# EAGLE design untitled (EAGLE 9.6.2)

## Sheet 1 of 5
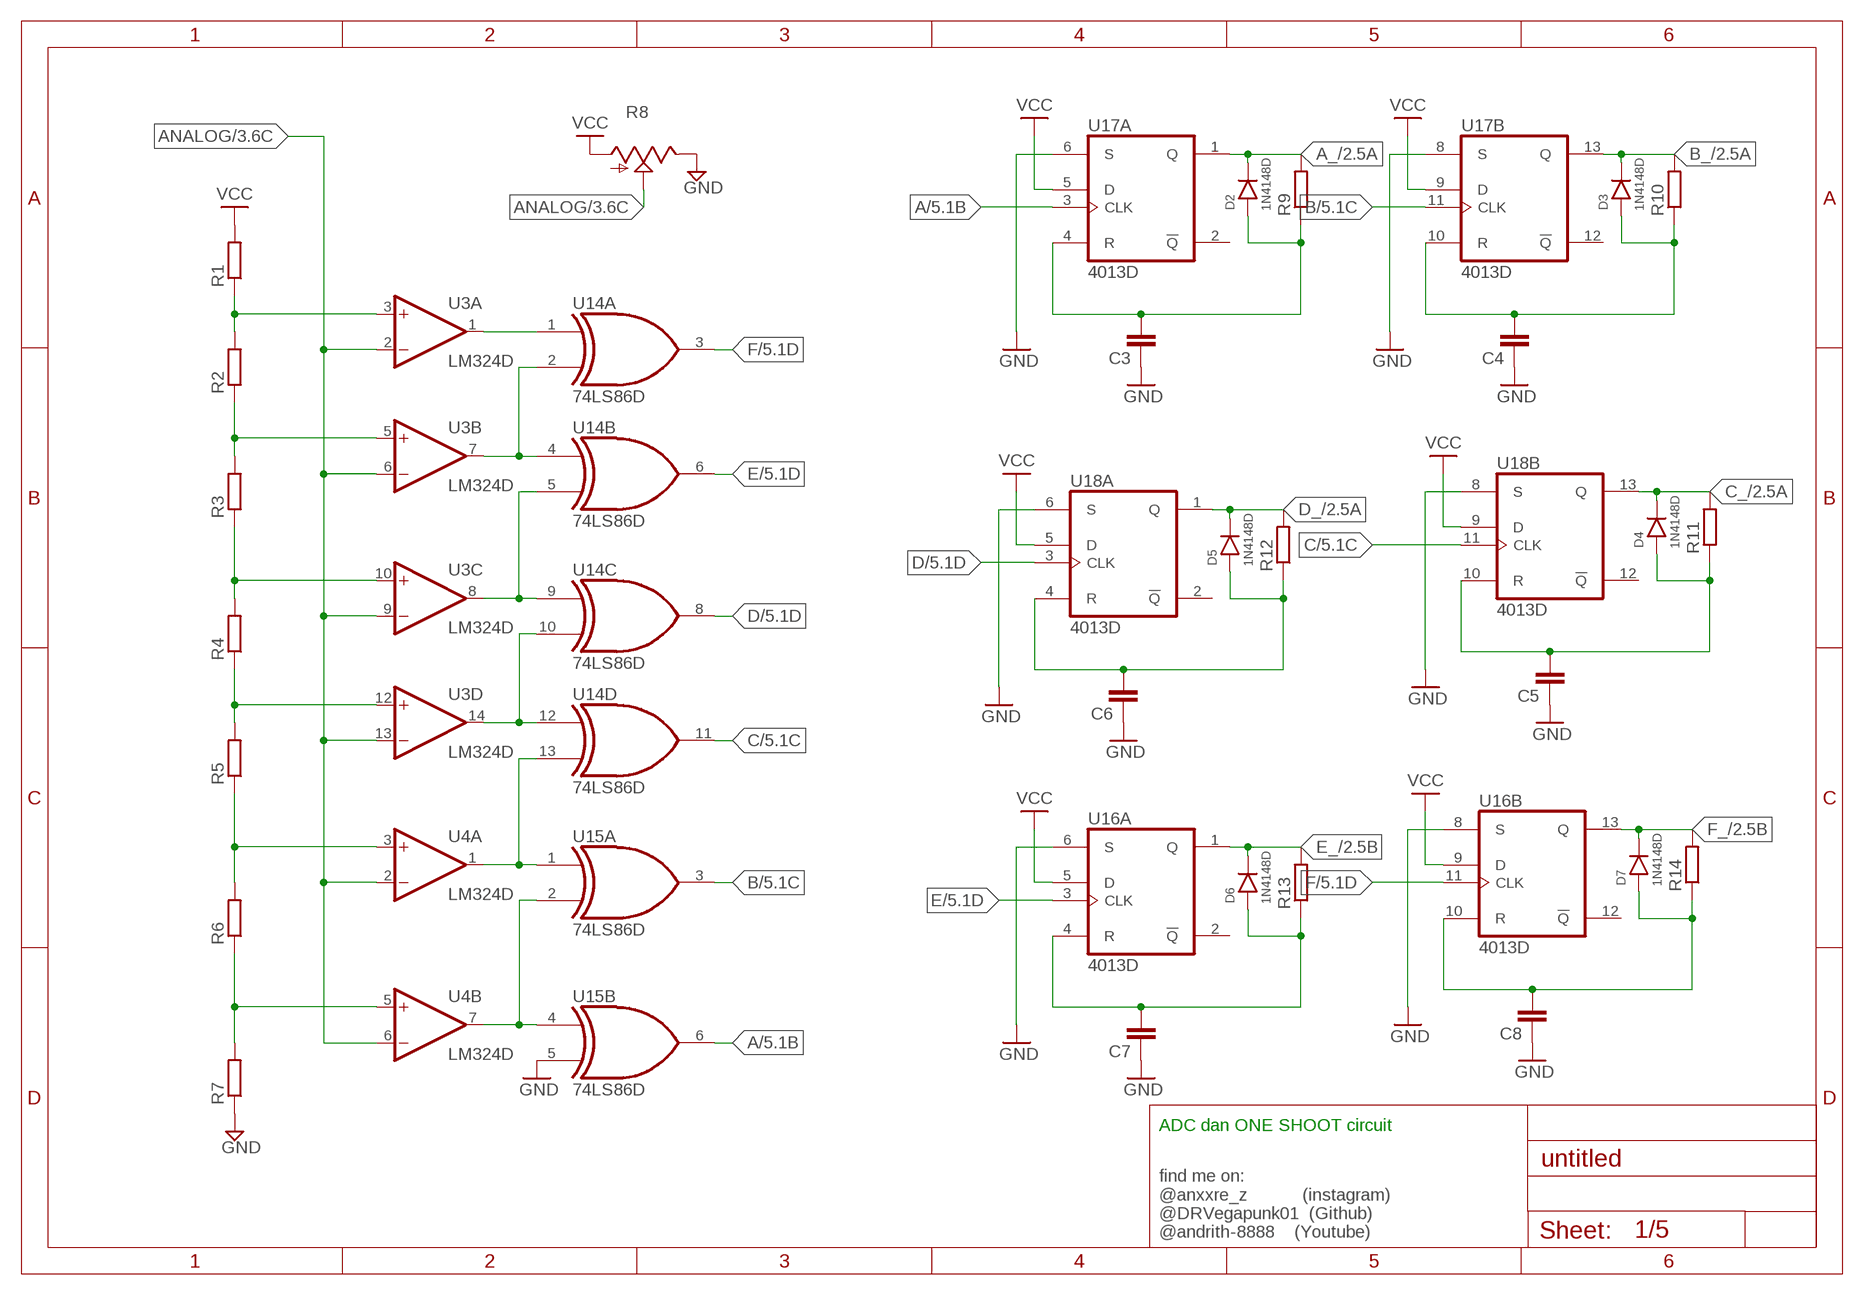
[diagram p0: schematic, sheet 1]

### Parts
C3  CAP-NON0805  [SMD0805]
C4  CAP-NON0805  [SMD0805]
C5  CAP-NON0805  [SMD0805]
C6  CAP-NON0805  [SMD0805]
C7  CAP-NON0805  [SMD0805]
C8  CAP-NON0805  [SMD0805]
D2  1N4148D  [SOD80C]
D3  1N4148D  [SOD80C]
D4  1N4148D  [SOD80C]
D5  1N4148D  [SOD80C]
D6  1N4148D  [SOD80C]
D7  1N4148D  [SOD80C]
R1  RES0805  [SMD0805]
R2  RES0805  [SMD0805]
R3  RES0805  [SMD0805]
R4  RES0805  [SMD0805]
R5  RES0805  [SMD0805]
R6  RES0805  [SMD0805]
R7  RES0805  [SMD0805]
R8  TRIM_US-CT6  [CT6]
R9  RES0805  [SMD0805]
R10  RES0805  [SMD0805]
R11  RES0805  [SMD0805]
R12  RES0805  [SMD0805]
R13  RES0805  [SMD0805]
R14  RES0805  [SMD0805]
U3  LM324D  [SO14]
U4  LM324D  [SO14]
U14  74LS86D  [SO14]
U15  74LS86D  [SO14]
U16  4013D  [SO14]
U17  4013D  [SO14]
U18  4013D  [SO14]

### Nets
A: U15.6(B:O) U17.3(A:CLK) ; also sheet 5
A_: D2.C R9.2 U17.1(A:Q) ; also sheet 2
ANALOG: R8.S U3.2(A:-IN) U3.6(B:-IN) U3.9(C:-IN) U3.13(D:-IN) U4.2(A:-IN) U4.6(B:-IN) ; also sheet 3
B: U15.3(A:O) U17.11(B:CLK) ; also sheet 5
B_: D3.C R10.2 U17.13(B:Q) ; also sheet 2
C: U14.11(D:O) U18.11(B:CLK) ; also sheet 5
C_: D4.C R11.2 U18.13(B:Q) ; also sheet 2
D: U14.8(C:O) U18.3(A:CLK) ; also sheet 5
D_: D5.C R12.2 U18.1(A:Q) ; also sheet 2
E: U14.6(B:O) U16.3(A:CLK) ; also sheet 5
E_: D6.C R13.2 U16.1(A:Q) ; also sheet 2
F: U14.3(A:O) U16.11(B:CLK) ; also sheet 5
F_: D7.C R14.2 U16.13(B:Q) ; also sheet 2
GND: C3.1 C4.1 C5.1 C6.1 C7.1 C8.1 R7.1 R8.E U15.5(B:I1) U16.6(A:S) U16.8(B:S) U17.6(A:S) U17.8(B:S) U18.6(A:S) U18.8(B:S) ; also sheet 3,4,5
N$3: R6.1 R7.2 U4.5(B:+IN)
N$4: R5.1 R6.2 U4.3(A:+IN)
N$5: R4.1 R5.2 U3.12(D:+IN)
N$6: R3.1 R4.2 U3.10(C:+IN)
N$7: R2.1 R3.2 U3.5(B:+IN)
N$8: R1.1 R2.2 U3.3(A:+IN)
N$9: U4.7(B:OUT) U15.2(A:I1) U15.4(B:I0)
N$10: U4.1(A:OUT) U14.13(D:I1) U15.1(A:I0)
N$11: U3.14(D:OUT) U14.10(C:I1) U14.12(D:I0)
N$12: C3.2 D2.A R9.1 U17.4(A:R)
N$13: U3.8(C:OUT) U14.5(B:I1) U14.9(C:I0)
N$14: U3.7(B:OUT) U14.2(A:I1) U14.4(B:I0)
N$15: U3.1(A:OUT) U14.1(A:I0)
N$16: C4.2 D3.A R10.1 U17.10(B:R)
N$19: C5.2 D4.A R11.1 U18.10(B:R)
N$21: C6.2 D5.A R12.1 U18.4(A:R)
N$23: C7.2 D6.A R13.1 U16.4(A:R)
N$25: C8.2 D7.A R14.1 U16.10(B:R)
VCC: R1.2 R8.A U16.5(A:D) U16.9(B:D) U17.5(A:D) U17.9(B:D) U18.5(A:D) U18.9(B:D) ; also sheet 3,4,5
Unconnected: U4.8(C:OUT) U4.9(C:-IN) U4.10(C:+IN) U4.12(D:+IN) U4.13(D:-IN) U4.14(D:OUT) U15.8(C:O) U15.9(C:I0) U15.10(C:I1) U15.11(D:O) U15.12(D:I0) U15.13(D:I1) U16.2(A:!Q) U16.12(B:!Q) U17.2(A:!Q) U17.12(B:!Q) U18.2(A:!Q) U18.12(B:!Q)

### Notes on the sheet
- ADC dan ONE SHOOT circuit
- find me on:
  @anxxre_z           (instagram)
  @DRVegapunk01  (Github)
  @andrith-8888    (Youtube)

## Sheet 2 of 5
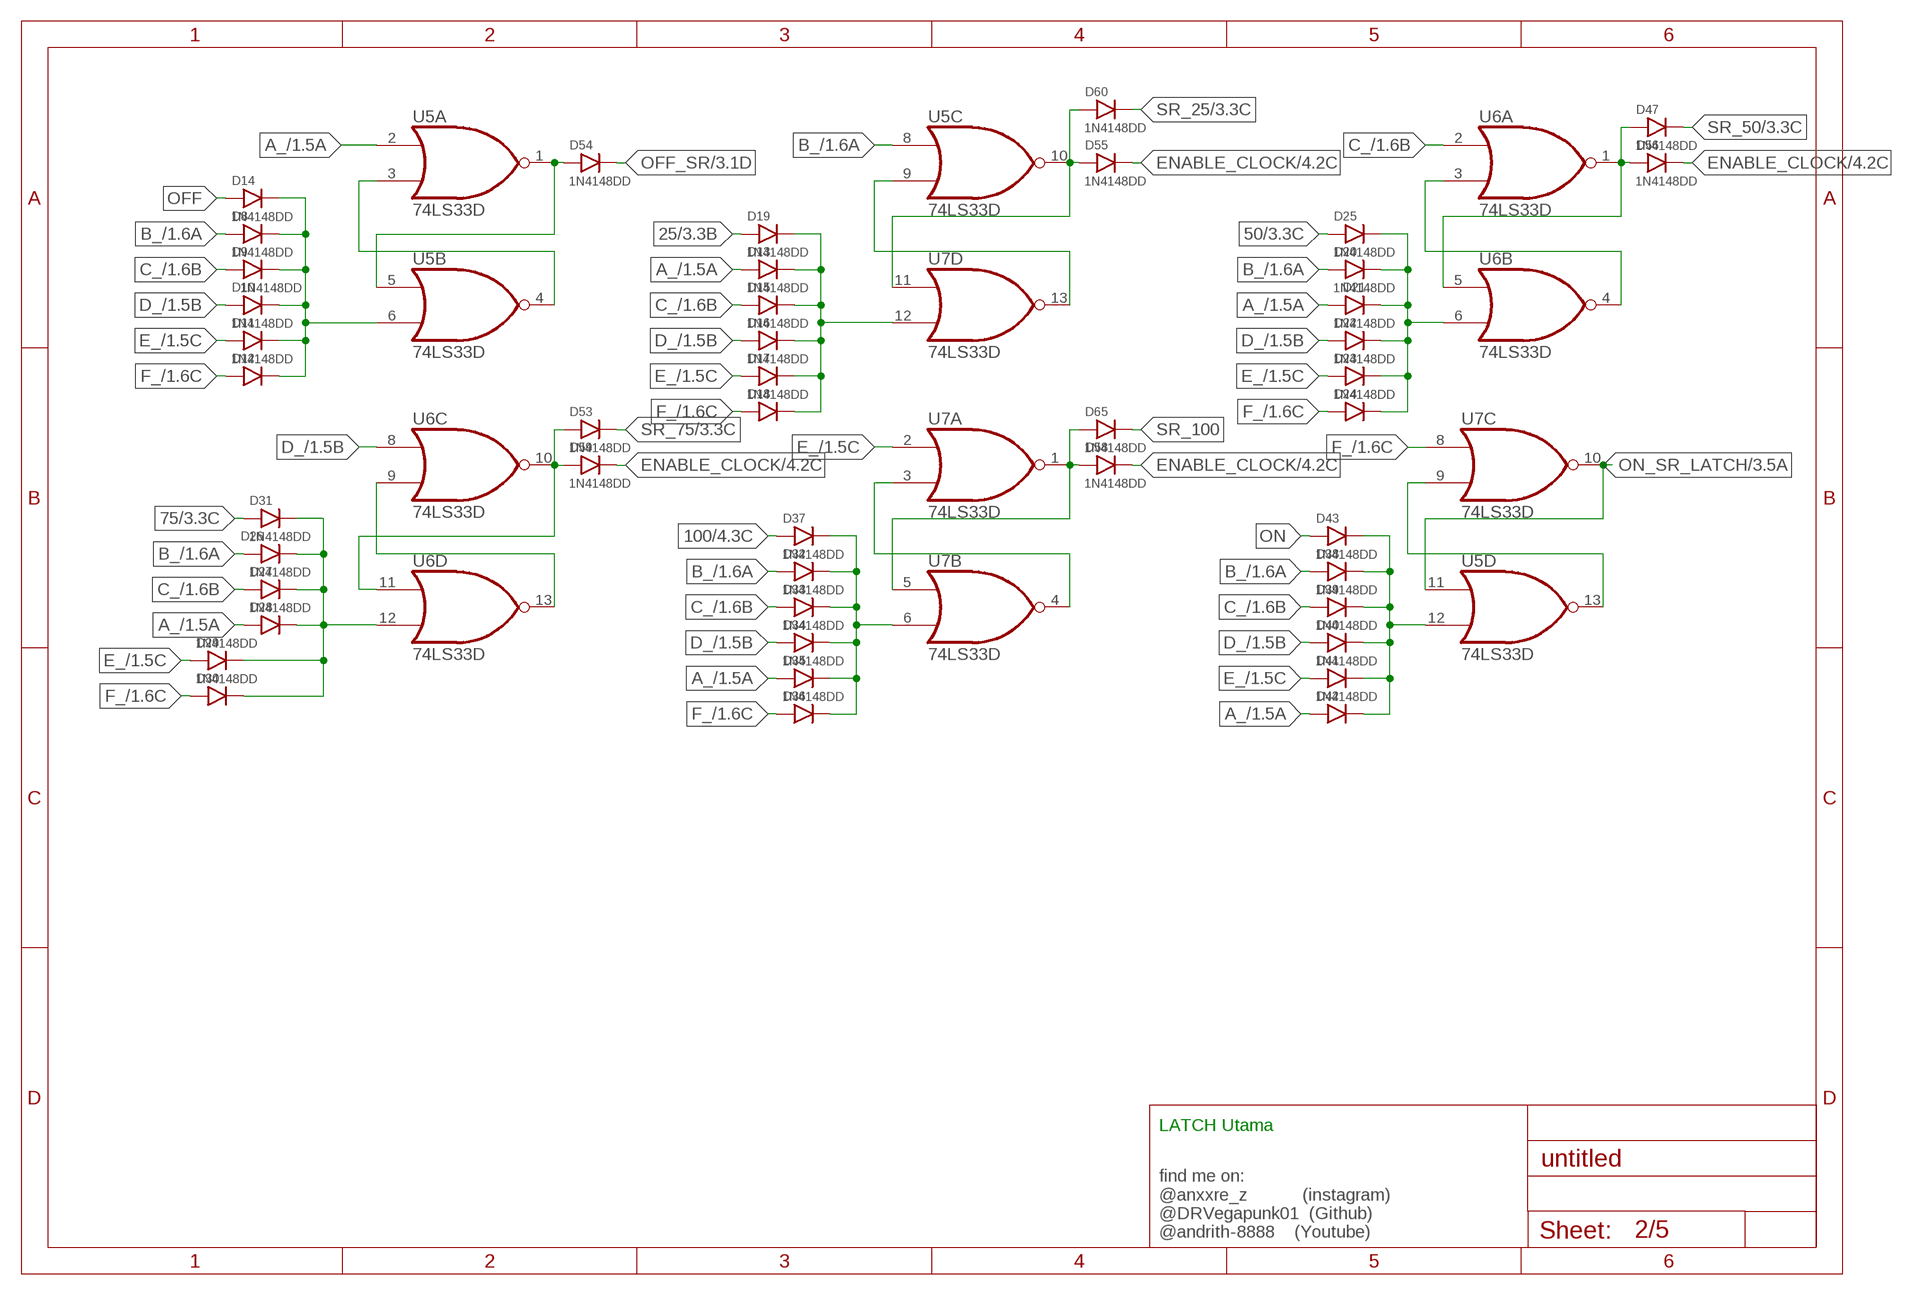
[diagram p1: schematic, sheet 2]

### Parts
D8  1N4148DD  [SOD123]
D9  1N4148DD  [SOD123]
D10  1N4148DD  [SOD123]
D11  1N4148DD  [SOD123]
D12  1N4148DD  [SOD123]
D13  1N4148DD  [SOD123]
D14  1N4148DD  [SOD123]
D15  1N4148DD  [SOD123]
D16  1N4148DD  [SOD123]
D17  1N4148DD  [SOD123]
D18  1N4148DD  [SOD123]
D19  1N4148DD  [SOD123]
D20  1N4148DD  [SOD123]
D21  1N4148DD  [SOD123]
D22  1N4148DD  [SOD123]
D23  1N4148DD  [SOD123]
D24  1N4148DD  [SOD123]
D25  1N4148DD  [SOD123]
D26  1N4148DD  [SOD123]
D27  1N4148DD  [SOD123]
D28  1N4148DD  [SOD123]
D29  1N4148DD  [SOD123]
D30  1N4148DD  [SOD123]
D31  1N4148DD  [SOD123]
D32  1N4148DD  [SOD123]
D33  1N4148DD  [SOD123]
D34  1N4148DD  [SOD123]
D35  1N4148DD  [SOD123]
D36  1N4148DD  [SOD123]
D37  1N4148DD  [SOD123]
D38  1N4148DD  [SOD123]
D39  1N4148DD  [SOD123]
D40  1N4148DD  [SOD123]
D41  1N4148DD  [SOD123]
D42  1N4148DD  [SOD123]
D43  1N4148DD  [SOD123]
D47  1N4148DD  [SOD123]
D53  1N4148DD  [SOD123]
D54  1N4148DD  [SOD123]
D55  1N4148DD  [SOD123]
D56  1N4148DD  [SOD123]
D58  1N4148DD  [SOD123]
D59  1N4148DD  [SOD123]
D60  1N4148DD  [SOD123]
D65  1N4148DD  [SOD123]
U5  74LS33D  [SO14]
U6  74LS33D  [SO14]
U7  74LS33D  [SO14]

### Nets
25: D19.A ; also sheet 3,4
50: D25.A ; also sheet 3,4
75: D31.A ; also sheet 3,4
100: D37.A ; also sheet 4
A_: D13.A D21.A D28.A D35.A D42.A U5.2(A:I0) ; also sheet 1
B_: D8.A D20.A D26.A D32.A D38.A U5.8(C:I0) ; also sheet 1
C_: D9.A D15.A D27.A D33.A D39.A U6.2(A:I0) ; also sheet 1
D_: D10.A D16.A D22.A D34.A D40.A U6.8(C:I0) ; also sheet 1
E_: D11.A D17.A D23.A D29.A D41.A U7.2(A:I0) ; also sheet 1
ENABLE_CLOCK: D55.C D56.C D58.C D59.C ; also sheet 4
F_: D12.A D18.A D24.A D30.A D36.A U7.8(C:I0) ; also sheet 1
N$20: U5.3(A:I1) U5.4(B:O)
N$22: D20.C D21.C D22.C D23.C D24.C D25.C U6.6(B:I1)
N$24: D8.C D9.C D10.C D11.C D12.C D14.C U5.6(B:I1)
N$26: D26.C D27.C D28.C D29.C D30.C D31.C U6.12(D:I1)
N$27: U6.9(C:I1) U6.13(D:O)
N$28: D32.C D33.C D34.C D35.C D36.C D37.C U7.6(B:I1)
N$29: D38.C D39.C D40.C D41.C D42.C D43.C U5.12(D:I1)
N$30: U7.3(A:I1) U7.4(B:O)
N$32: U5.9(C:I1) U7.13(D:O)
N$34: U6.3(A:I1) U6.4(B:O)
N$36: U5.13(D:O) U7.9(C:I1)
N$41: D13.C D15.C D16.C D17.C D18.C D19.C U7.12(D:I1)
OFF: D14.A
OFF_SR: D54.C ; also sheet 3
ON: D43.A
ON_SR_LATCH: U5.11(D:I0) U7.10(C:O) ; also sheet 3
Q1: D54.A U5.1(A:O) U5.5(B:I0)
Q2: D55.A D60.A U5.10(C:O) U7.11(D:I0)
Q3: D47.A D56.A U6.1(A:O) U6.5(B:I0)
Q4: D53.A D59.A U6.10(C:O) U6.11(D:I0)
Q5: D58.A D65.A U7.1(A:O) U7.5(B:I0)
SR_25: D60.C ; also sheet 3
SR_50: D47.C ; also sheet 3
SR_75: D53.C ; also sheet 3
SR_100: D65.C

### Notes on the sheet
- LATCH Utama
- find me on:
  @anxxre_z           (instagram)
  @DRVegapunk01  (Github)
  @andrith-8888    (Youtube)

## Sheet 3 of 5
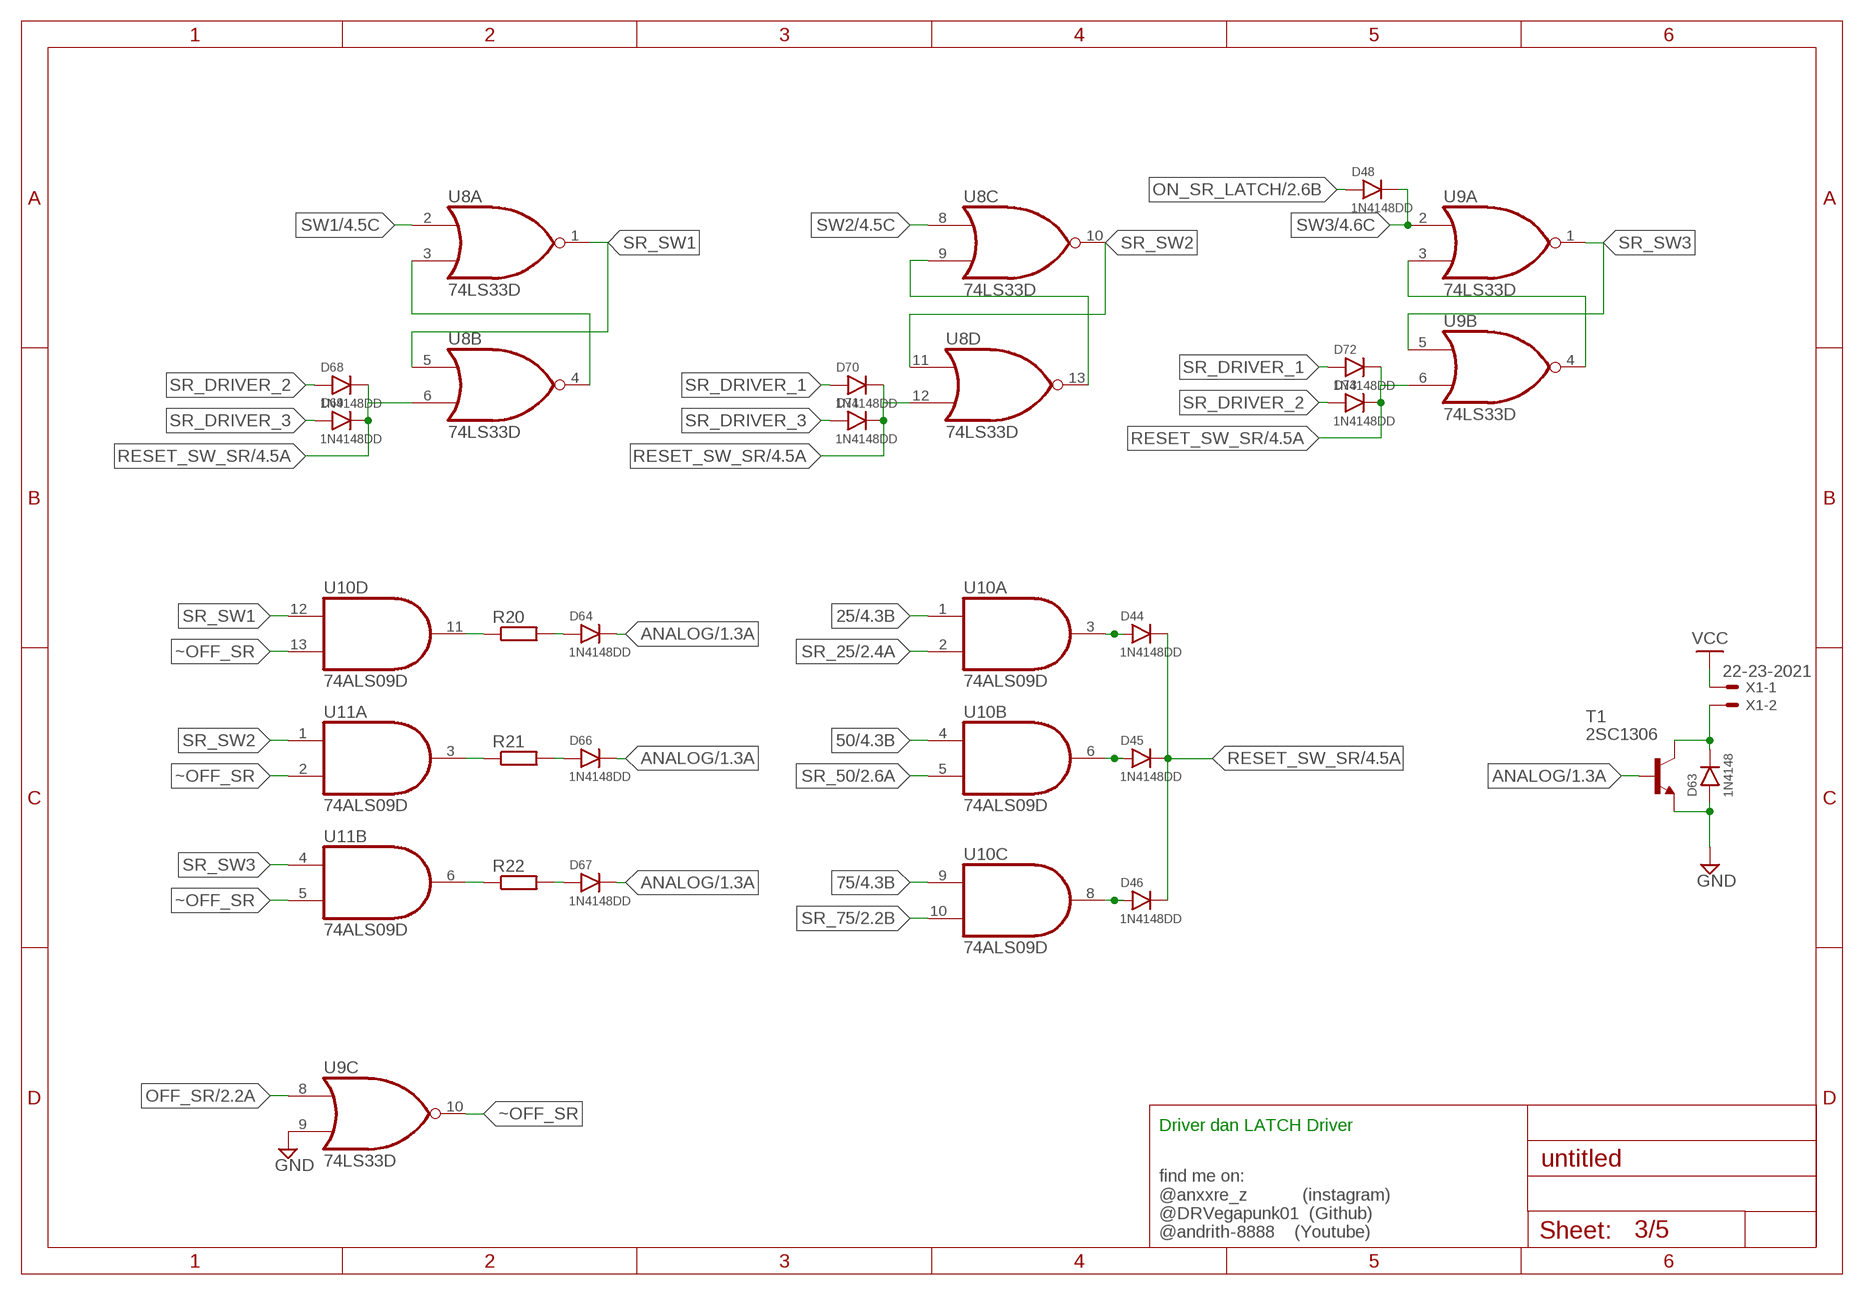
[diagram p2: schematic, sheet 3]

### Parts
D44  1N4148DD  [SOD123]
D45  1N4148DD  [SOD123]
D46  1N4148DD  [SOD123]
D48  1N4148DD  [SOD123]
D63  1N4148  [DIODE]
D64  1N4148DD  [SOD123]
D66  1N4148DD  [SOD123]
D67  1N4148DD  [SOD123]
D68  1N4148DD  [SOD123]
D69  1N4148DD  [SOD123]
D70  1N4148DD  [SOD123]
D71  1N4148DD  [SOD123]
D72  1N4148DD  [SOD123]
D73  1N4148DD  [SOD123]
R20  RES0805  [SMD0805]
R21  RES0805  [SMD0805]
R22  RES0805  [SMD0805]
T1  2SC1306  [TO220BV]
U8  74LS33D  [SO14]
U9  74LS33D  [SO14]
U10  74ALS09D  [SO14]
U11  74ALS09D  [SO14]
X1  22-23-2021  [22-23-2021]

### Nets
25: U10.1(A:I0) ; also sheet 2,4
50: U10.4(B:I0) ; also sheet 2,4
75: U10.9(C:I0) ; also sheet 2,4
ANALOG: D64.C D66.C D67.C T1.1(B) ; also sheet 1
GND: D63.1 T1.3(E) U9.9(C:I1) ; also sheet 1,4,5
N$39: R22.1 U11.6(B:O)
N$40: D67.A R22.2
N$43: U8.3(A:I1) U8.4(B:O)
N$45: D66.A R21.2
N$46: R21.1 U11.3(A:O)
N$47: D63.2 T1.2(C) X1.2
N$48: D64.A R20.2
N$49: R20.1 U10.11(D:O)
N$51: U8.9(C:I1) U8.13(D:O)
N$53: D44.A U10.3(A:O)
N$54: D45.A U10.6(B:O)
N$55: D46.A U10.8(C:O)
N$56: U9.3(A:I1) U9.4(B:O)
OFF_SR: U9.8(C:I0) ; also sheet 2
ON_SR_LATCH: D48.A ; also sheet 2
RESET_SW_SR: D44.C D45.C D46.C D68.C D69.C D70.C D71.C D72.C D73.C U8.6(B:I1) U8.12(D:I1) U9.6(B:I1) ; also sheet 4
SR_25: U10.2(A:I1) ; also sheet 2
SR_50: U10.5(B:I1) ; also sheet 2
SR_75: U10.10(C:I1) ; also sheet 2
SR_DRIVER_1: D70.A D72.A
SR_DRIVER_2: D68.A D73.A
SR_DRIVER_3: D69.A D71.A
SR_SW1: U8.1(A:O) U8.5(B:I0) U10.12(D:I0)
SR_SW2: U8.10(C:O) U8.11(D:I0) U11.1(A:I0)
SR_SW3: U9.1(A:O) U9.5(B:I0) U11.4(B:I0)
SW1: U8.2(A:I0) ; also sheet 4
SW2: U8.8(C:I0) ; also sheet 4
SW3: D48.C U9.2(A:I0) ; also sheet 4
VCC: X1.1 ; also sheet 1,4,5
~OFF_SR: U9.10(C:O) U10.13(D:I1) U11.2(A:I1) U11.5(B:I1)
Unconnected: U9.11(D:I0) U9.12(D:I1) U9.13(D:O) U11.8(C:O) U11.9(C:I0) U11.10(C:I1) U11.11(D:O) U11.12(D:I0) U11.13(D:I1)

### Notes on the sheet
- Driver dan LATCH Driver
- find me on:
  @anxxre_z           (instagram)
  @DRVegapunk01  (Github)
  @andrith-8888    (Youtube)

## Sheet 4 of 5
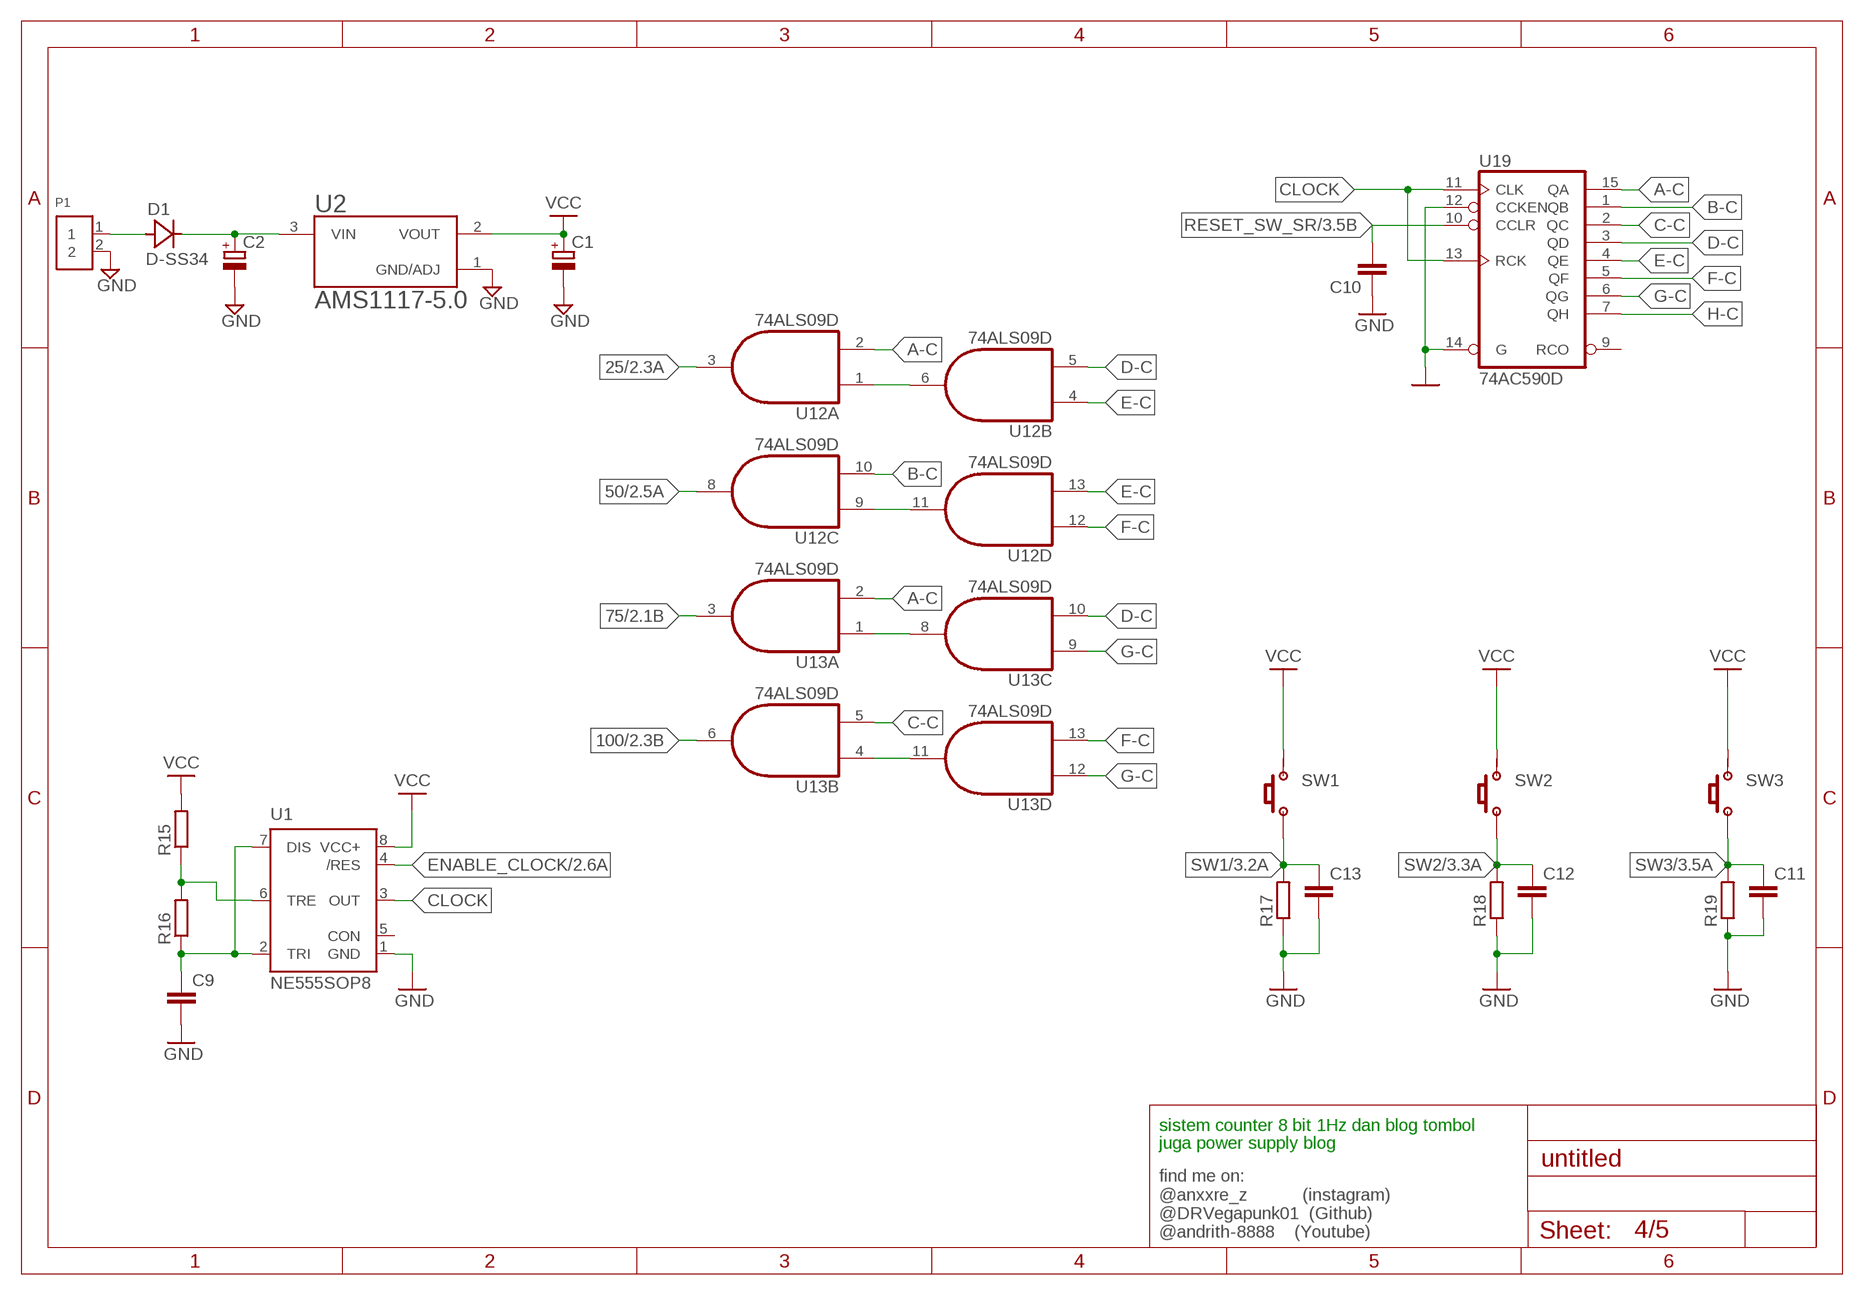
[diagram p3: schematic, sheet 4]

### Parts
C1  CAP-POLARE5-4  [E5-4]
C2  CAP-POLARE5-4  [E5-4]
C9  CAP-NON0805  [SMD0805]
C10  CAP-NON0805  [SMD0805]
C11  CAP-NON0805  [SMD0805]
C12  CAP-NON0805  [SMD0805]
C13  CAP-NON0805  [SMD0805]
D1  D-SS34  [SMA]
P1  TERMINALBLOK  [TB-2P]
R15  RES0805  [SMD0805]
R16  RES0805  [SMD0805]
R17  RES0805  [SMD0805]
R18  RES0805  [SMD0805]
R19  RES0805  [SMD0805]
SW1  PUSH_BUTTON4P  [PUSH_BUTTON_4P]
SW2  PUSH_BUTTON4P  [PUSH_BUTTON_4P]
SW3  PUSH_BUTTON4P  [PUSH_BUTTON_4P]
U1  NE555SOP8  [SO08]
U2  AMS1117-5.0  [SOT229P700X180-4N]
U12  74ALS09D  [SO14]
U13  74ALS09D  [SO14]
U19  74AC590D  [SO16]

### Nets
25: U12.3(A:O) ; also sheet 2,3
50: U12.8(C:O) ; also sheet 2,3
75: U13.3(A:O) ; also sheet 2,3
100: U13.6(B:O) ; also sheet 2
A-C: U12.2(A:I1) U13.2(A:I1) U19.15(QA)
B-C: U12.10(C:I1) U19.1(QB)
C-C: U13.5(B:I1) U19.2(QC)
CLOCK: U1.3(OUT) U19.11(CLK) U19.13(RCK)
D-C: U12.5(B:I1) U13.10(C:I1) U19.3(QD)
E-C: U12.4(B:I0) U12.13(D:I1) U19.4(QE)
ENABLE_CLOCK: U1.4(/RES) ; also sheet 2
F-C: U12.12(D:I0) U13.13(D:I1) U19.5(QF)
G-C: U13.9(C:I0) U13.12(D:I0) U19.6(QG)
GND: C1.- C2.- C9.2 C10.2 C11.2 C12.2 C13.2 P1.2 R17.1 R18.1 R19.1 U1.1(GND) U2.1(GND/ADJ) U19.12(CCKEN) U19.14(G) ; also sheet 1,3,5
H-C: U19.7(QH)
N$1: D1.A P1.1
N$2: C2.+ D1.C U2.3(VIN)
N$17: C9.1 R16.1 U1.2(TRI) U1.7(DIS)
N$18: R15.1 R16.2 U1.6(TRE)
N$31: U12.1(A:I0) U12.6(B:O)
N$33: U12.9(C:I0) U12.11(D:O)
N$35: U13.1(A:I0) U13.8(C:O)
N$37: U13.4(B:I0) U13.11(D:O)
RESET_SW_SR: C10.1 U19.10(CCLR) ; also sheet 3
SW1: C13.1 R17.2 SW1.1 SW1.2 ; also sheet 3
SW2: C12.1 R18.2 SW2.1 SW2.2 ; also sheet 3
SW3: C11.1 R19.2 SW3.1 SW3.2 ; also sheet 3
VCC: C1.+ R15.2 SW1.3 SW1.4 SW2.3 SW2.4 SW3.3 SW3.4 U1.8(VCC+) U2.2(VOUT) ; also sheet 1,3,5
Unconnected: U1.5(CON) U19.9(RCO)

### Notes on the sheet
- sistem counter 8 bit 1Hz dan blog tombol
- juga power supply blog
- find me on:
  @anxxre_z           (instagram)
  @DRVegapunk01  (Github)
  @andrith-8888    (Youtube)

## Sheet 5 of 5
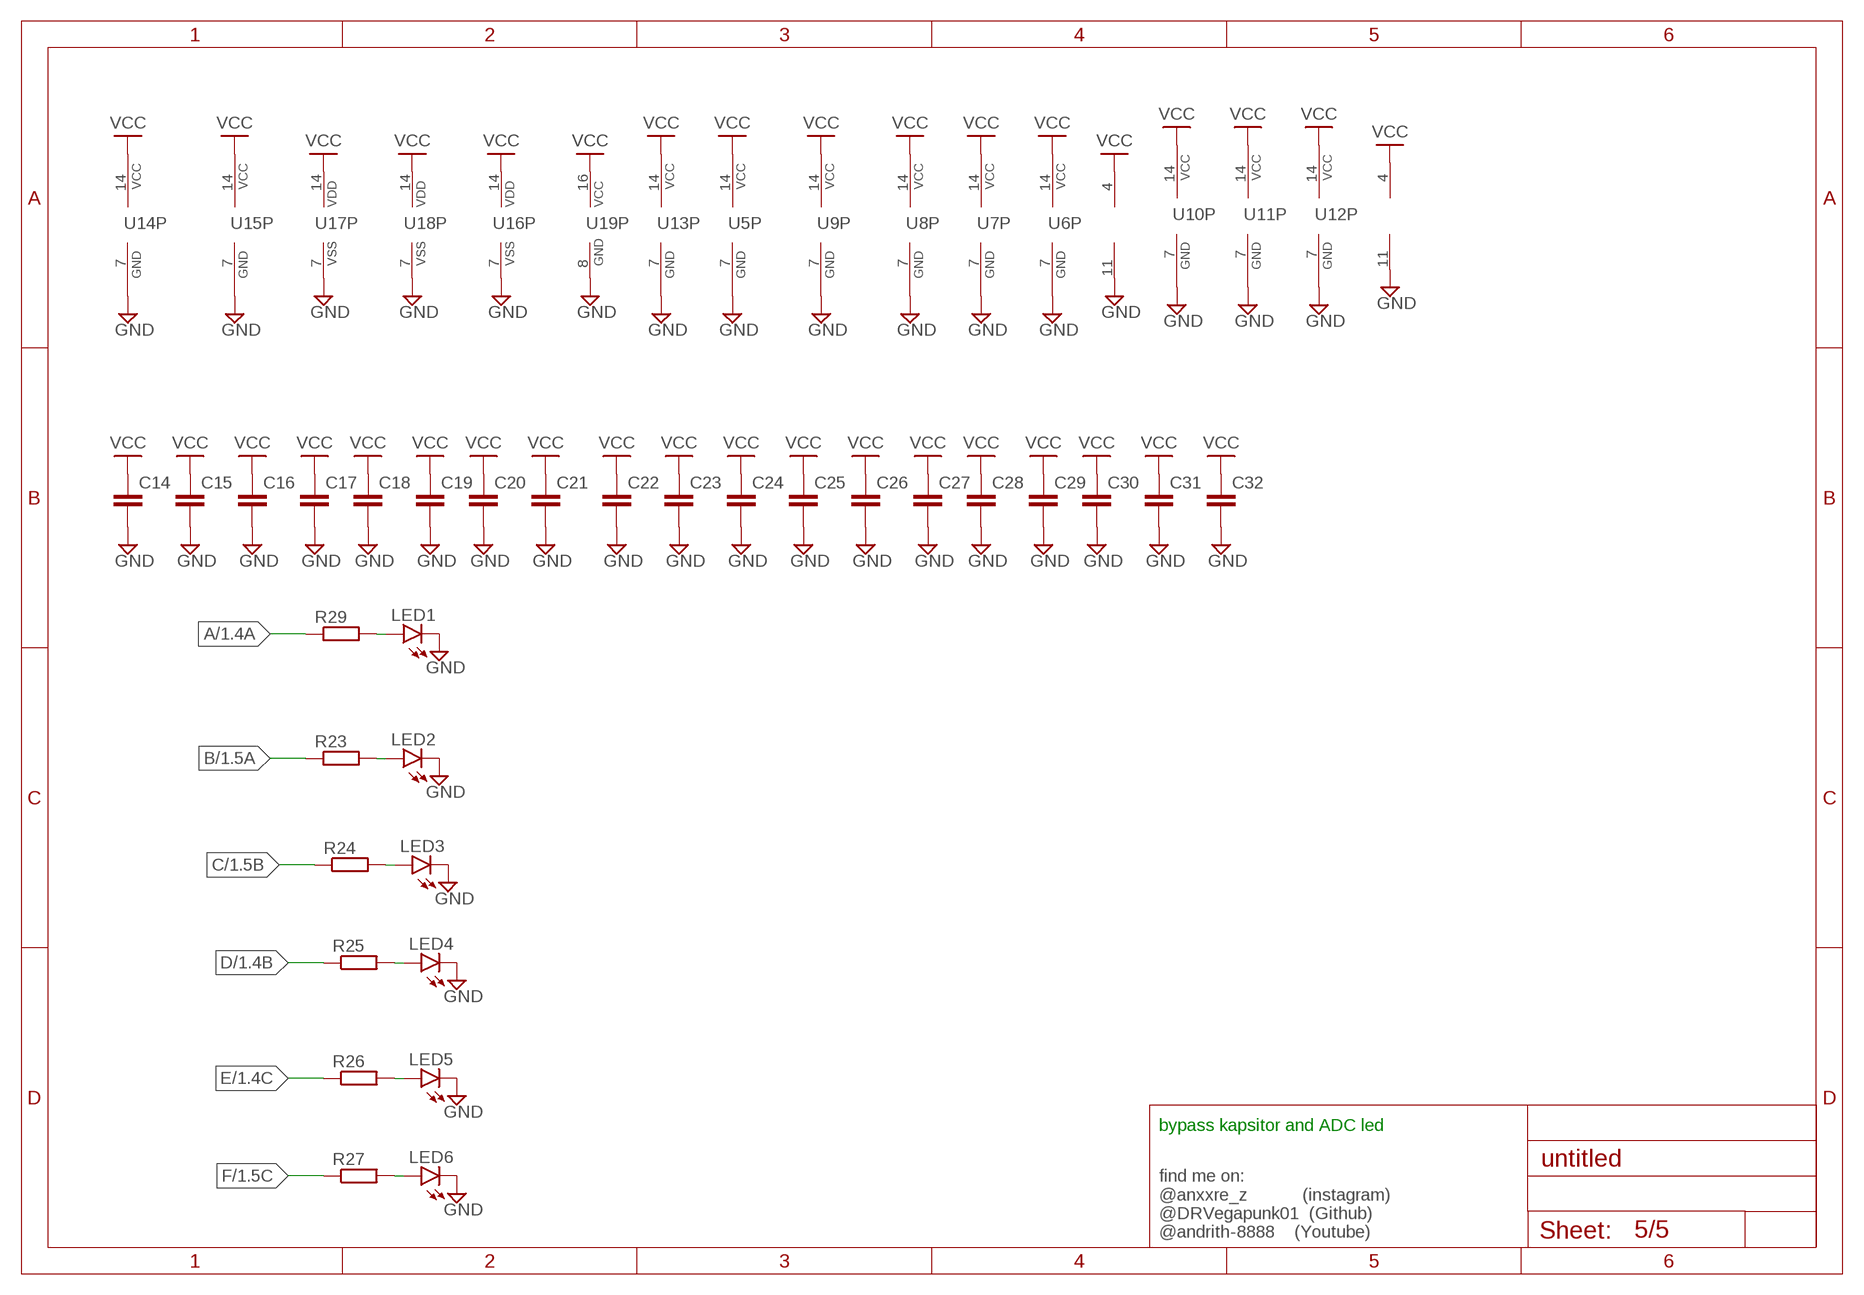
[diagram p4: schematic, sheet 5]

### Parts
C14  CAP-NON0805  [SMD0805]
C15  CAP-NON0805  [SMD0805]
C16  CAP-NON0805  [SMD0805]
C17  CAP-NON0805  [SMD0805]
C18  CAP-NON0805  [SMD0805]
C19  CAP-NON0805  [SMD0805]
C20  CAP-NON0805  [SMD0805]
C21  CAP-NON0805  [SMD0805]
C22  CAP-NON0805  [SMD0805]
C23  CAP-NON0805  [SMD0805]
C24  CAP-NON0805  [SMD0805]
C25  CAP-NON0805  [SMD0805]
C26  CAP-NON0805  [SMD0805]
C27  CAP-NON0805  [SMD0805]
C28  CAP-NON0805  [SMD0805]
C29  CAP-NON0805  [SMD0805]
C30  CAP-NON0805  [SMD0805]
C31  CAP-NON0805  [SMD0805]
C32  CAP-NON0805  [SMD0805]
LED1  LED0805  [CHIPLED_0805]
LED2  LED0805  [CHIPLED_0805]
LED3  LED0805  [CHIPLED_0805]
LED4  LED0805  [CHIPLED_0805]
LED5  LED0805  [CHIPLED_0805]
LED6  LED0805  [CHIPLED_0805]
R23  RES0805  [SMD0805]
R24  RES0805  [SMD0805]
R25  RES0805  [SMD0805]
R26  RES0805  [SMD0805]
R27  RES0805  [SMD0805]
R29  RES0805  [SMD0805]

### Nets
A: R29.1 ; also sheet 1
B: R23.1 ; also sheet 1
C: R24.1 ; also sheet 1
D: R25.1 ; also sheet 1
E: R26.1 ; also sheet 1
F: R27.1 ; also sheet 1
GND: C14.2 C15.2 C16.2 C17.2 C18.2 C19.2 C20.2 C21.2 C22.2 C23.2 C24.2 C25.2 C26.2 C27.2 C28.2 C29.2 C30.2 C31.2 C32.2 LED1.C LED2.C LED3.C LED4.C LED5.C LED6.C U3.11(P:V-) U4.11(P:V-) U5.7(P:GND) U6.7(P:GND) U7.7(P:GND) U8.7(P:GND) U9.7(P:GND) U10.7(P:GND) U11.7(P:GND) U12.7(P:GND) U13.7(P:GND) U14.7(P:GND) U15.7(P:GND) U16.7(P:VSS) U17.7(P:VSS) U18.7(P:VSS) U19.8(GND) ; also sheet 1,3,4
N$38: LED3.A R24.2
N$42: LED4.A R25.2
N$44: LED5.A R26.2
N$50: LED6.A R27.2
N$57: LED1.A R29.2
N$63: LED2.A R23.2
VCC: C14.1 C15.1 C16.1 C17.1 C18.1 C19.1 C20.1 C21.1 C22.1 C23.1 C24.1 C25.1 C26.1 C27.1 C28.1 C29.1 C30.1 C31.1 C32.1 U3.4(P:V+) U4.4(P:V+) U5.14(P:VCC) U6.14(P:VCC) U7.14(P:VCC) U8.14(P:VCC) U9.14(P:VCC) U10.14(P:VCC) U11.14(P:VCC) U12.14(P:VCC) U13.14(P:VCC) U14.14(P:VCC) U15.14(P:VCC) U16.14(P:VDD) U17.14(P:VDD) U18.14(P:VDD) U19.16(VCC) ; also sheet 1,3,4

### Notes on the sheet
- bypass kapsitor and ADC led
- find me on:
  @anxxre_z           (instagram)
  @DRVegapunk01  (Github)
  @andrith-8888    (Youtube)

## Library data of the parts
C1 C2 = 00-2024-SelekdaWSA:CAP-POLAR: POLARIZED CAPACITOR, European symbol
C3-C32 = LKS_NAS_2024_PHD_A2_Library:CAP-NON
D1 = 00-2024-SelekdaWSA:D-SS34: Surface Mount Schottky Power Rectifier Source: http://www.onsemi.com/pub_link/Collateral/MBRA340T3-D.PDF
D2-D48 D53-D56 D58-D60 D63-D73 = LKS_NAS_2024_PHD_A2_Library:1N4148
LED1-LED6 = LKS_NAS_2024_PHD_A2_Library:LED: LED OSRAM: - CHIPLED LG R971, LG N971, LY N971, LG Q971, LY Q971, LO R971, LY R971 LH N974, LH R974 LS Q976, LO Q976, LY Q976 LO Q996 - Hyper CHIPLED LW Q18S LB Q993, LB Q99A, LB R99A - SideLED LS A670, LO A670, LY A670, LG A670, LP A670 LB A673, LV A673, LT A673, LW A673 LH A674 LY A675 LS A676, LA A676, LO A676, LY A676, LW A676 LS A679, LY A679, LG A679 - Hyper Micro SIDELED® LS Y876, LA Y876, LO Y876, LY Y876 LT Y87S - SmartLED LW L88C, LW L88S LB L89C, LB L89S, LG L890 LS L89K, LO L89K, LY L89K LS L896, LA L896, LO L896, LY L896 - TOPLED LS T670, LO T670, LY T670, LG T670, LP T670 LSG T670, LSP T670, LSY T670, LOP T670, LYG T670 LG T671, LOG T671, LSG T671 LB T673, LV T673, LT T673, LW T673 LH T674 LS T676, LA T676, LO T676, LY T676, LB T676, LH T676, LSB T676, LW T676 LB T67C, LV T67C, LT T67C, LS T67K, LO T67K, LY T67K, LW E67C LS E67B, LA E67B, LO E67B, LY E67B, LB E67C, LV E67C, LT E67C LW T67C LS T679, LY T679, LG T679 LS T770, LO T770, LY T770, LG T770, LP T770 LB T773, LV T773, LT T773, LW T773 LH T774 LS E675, LA E675, LY E675, LS T675 LS T776, LA T776, LO T776, LY T776, LB T776 LHGB T686 LT T68C, LB T68C - Hyper Mini TOPLED® LB M676 - Mini TOPLED Santana® LG M470 LS M47K, LO M47K, LY M47K Source: http://www.osram.convergy.de LUXEON: - LUMILED® LXK2-PW12-R00, LXK2-PW12-S00, LXK2-PW14-U00, LXK2-PW14-V00 LXK2-PM12-R00, LXK2-PM12-S00, LXK2-PM14-U00 LXK2-PE12-Q00, LXK2-PE12-R00, LXK2-PE12-S00, LXK2-PE14-T00, LXK2-PE14-U00 LXK2-PB12-K00, LXK2-PB12-L00, LXK2-PB12-M00, LXK2-PB14-N00, LXK2-PB14-P00, LXK2-PB14-Q00 LXK2-PR12-L00, LXK2-PR12-M00, LXK2-PR14-Q00, LXK2-PR14-R00 LXK2-PD12-Q00, LXK2-PD12-R00, LXK2-PD12-S00 LXK2-PH12-R00, LXK2-PH12-S00 LXK2-PL12-P00, LXK2-PL12-Q00, LXK2-PL12-R00 Source: www.luxeon.com KINGBRIGHT: KA-3528ASYC Source: www.kingbright.com
P1 = 00-2024-SelekdaWSA:TERMINALBLOK
R1-R7 R9-R27 R29 = LKS_NAS_2024_PHD_A2_Library:RES: RESISTOR, European symbol
R8 = pot:TRIM_US-: POTENTIOMETER
SW1-SW3 = LKS_NAS_2024_PHD_A2_Library:PUSH_BUTTON
T1 = transistor-neu-to92:2SC1306: NPN Transistor Final RF Power Outupt Source: 2sc1306.pdf
U1 = LKS_NAS_2024_PHD_A2_Library:NE555: General purpose bipolar Timer
U2 = 00-2024-SelekdaWSA:AMS1117-5.0: Check availability <https://pricing.snapeda.com/parts/AMS1117-5.0/Advanced%20Monolithic%20Systems/view-part?ref=eda>
U3 U4 = LKS_NAS_2024_PHD_A2_Library:LM324: OP AMP
U5-U9 = 74xx-us:74*33: Quad 2-input NOR buffer, open collector
U10-U13 = 74xx-us:74*09: Quad 2-input AND gate, open collector
U14 U15 = 74xx-us:74*86: Quad 2-input EXCLUSIV-OR (XOR) gate
U16-U18 = 40xx:4013: Dual D FLIP FLOP, set/reset
U19 = 74xx-eu:74*590: 8-bit binary COUNTER, output register
X1 = con-molex:22-23-2021: .100" (2.54mm) Center Header - 2 Pin; MF: MOLEX; MPN: 22-23-2021; OC_FARNELL: 1462926; OC_NEWARK: 25C3832

## Board
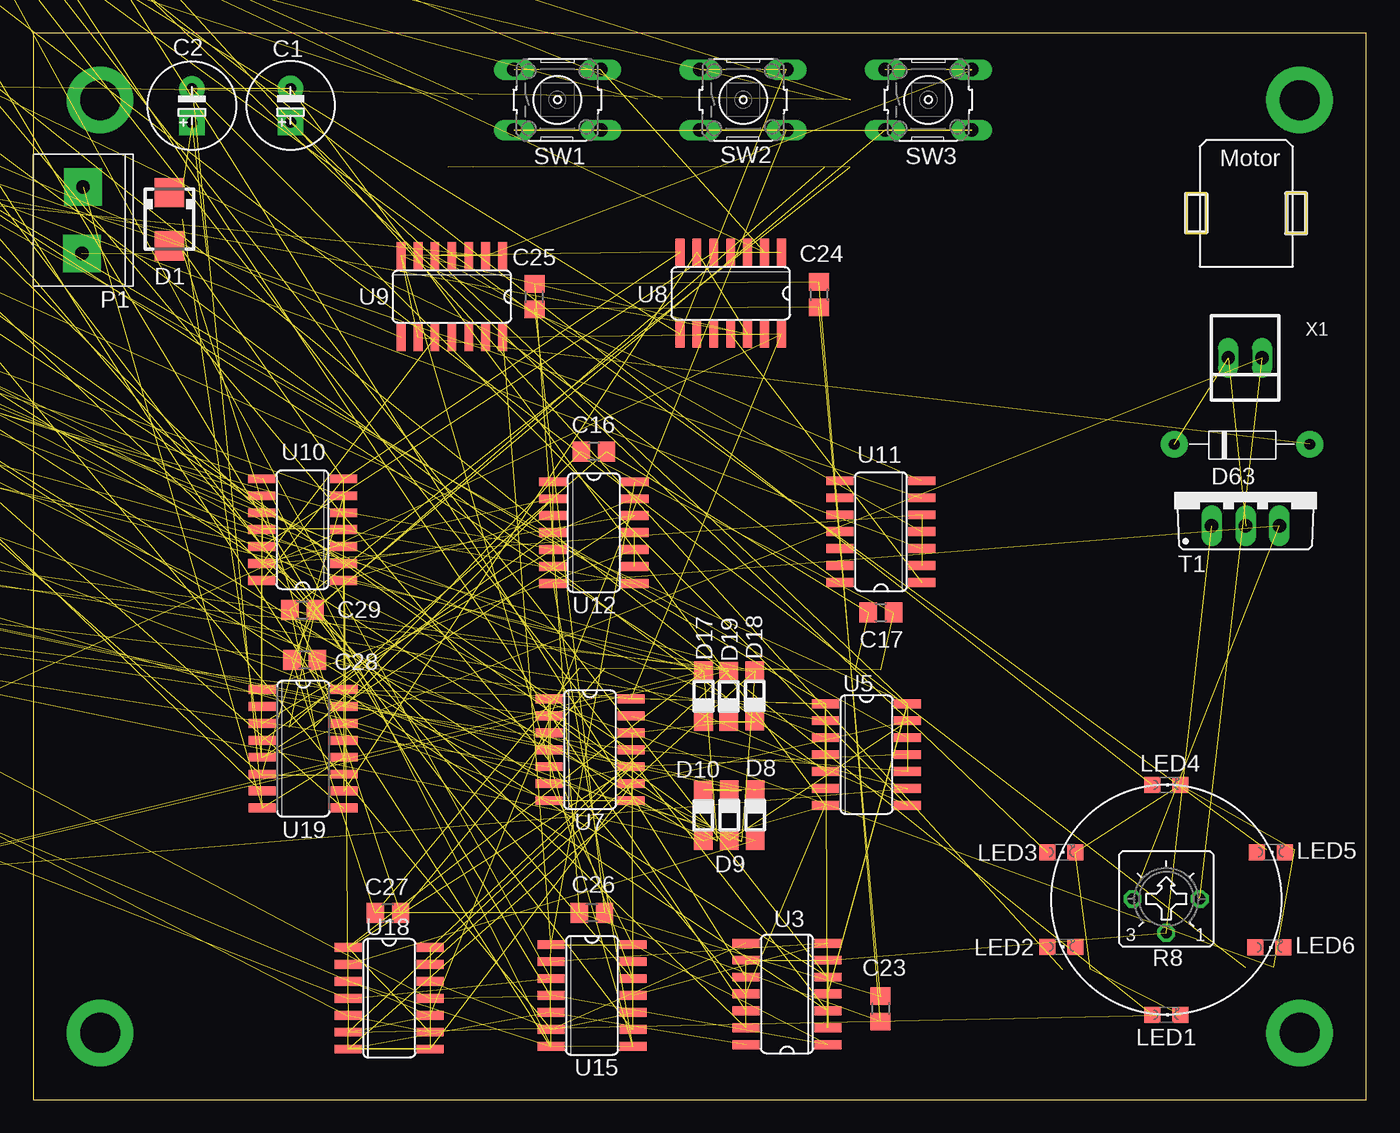
[diagram p5: board, top side]
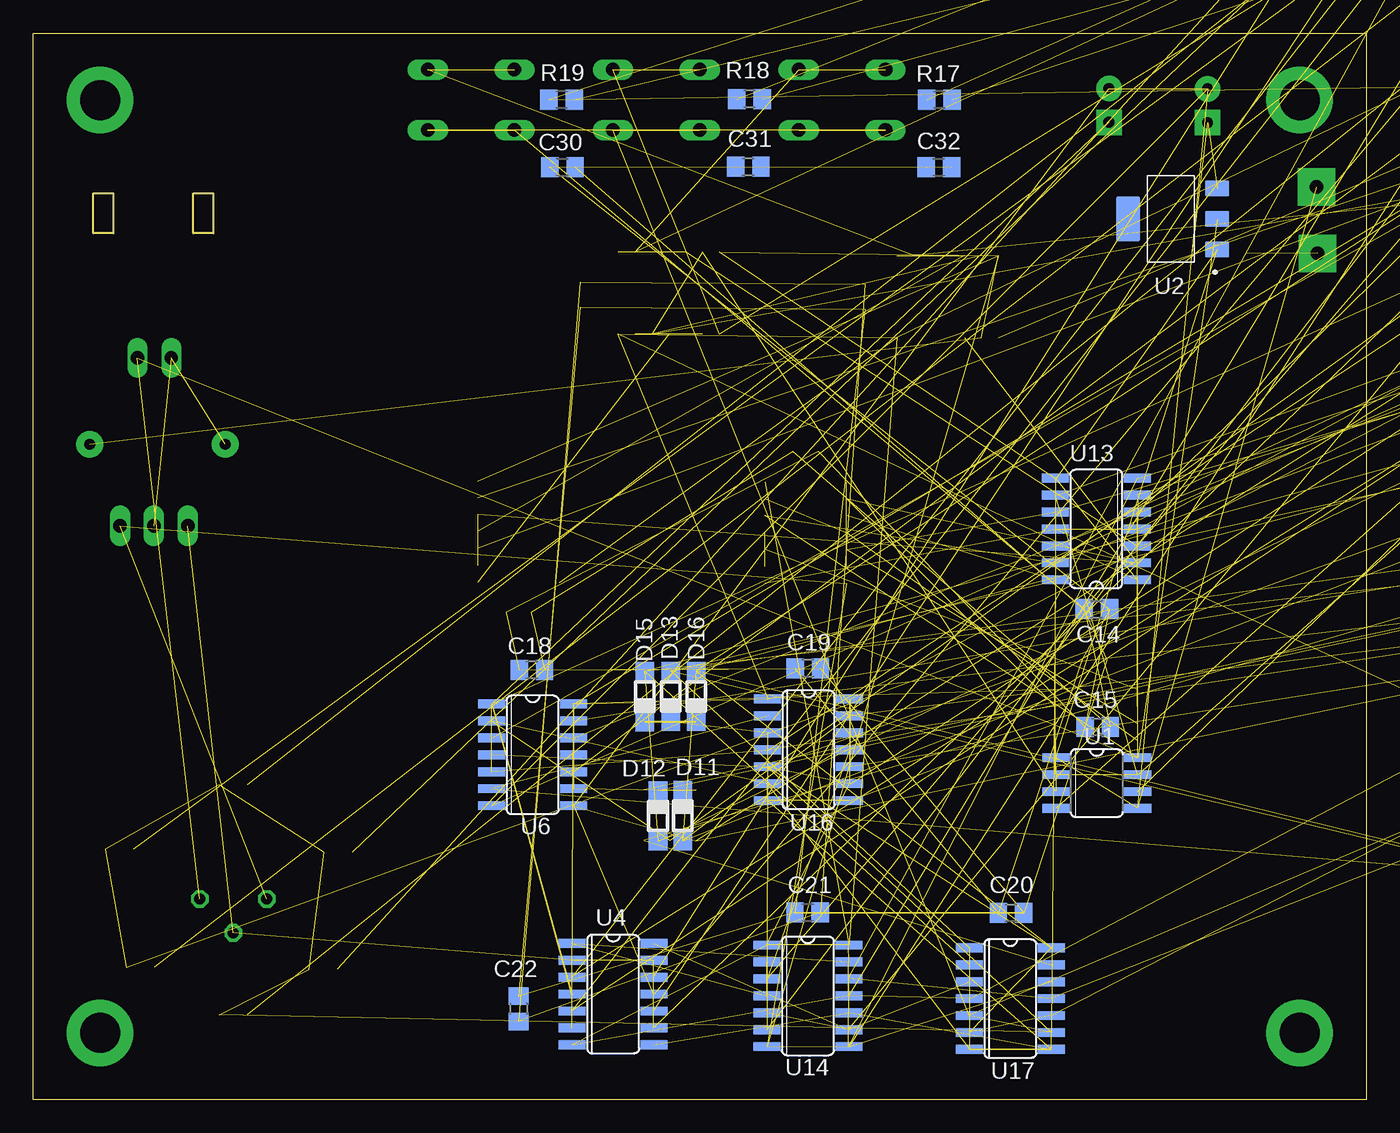
[diagram p6: board, bottom side, seen from below]

Size 100 x 80 mm. Coordinates in mm from the lower left corner, seen from the top.
Outline: 0,0 100,0 100,80 0,80 0,0
Outline: 86.5,68 86.5,65 88,65 88,68 86.5,68
Outline: 94,68 94,65 95.5,65 95.5,68 94,68
Copper layers (1*16): Top 0.035mm / dielectric 1.5mm / Bottom 0.035mm
Design rules "default": minimum track width 12mil, minimum drill 30mil, track to track 12mil, track to pad 12mil, pad to pad 12mil, via to via 6mil, smd to smd 6mil, copper to edge 24mil, drill to drill 6mil, minimum pad ring 10mil, minimum via ring 8mil, stop-mask expansion 4mil, vias tented up to drill 0mil, thermal gap 12mil

### Footprints (pad centres in the part's own frame; a part is rotated, then mirrored left to right if it is on the bottom)
E5-4 = drill 0.813 pad 1.905 square: + -1.27,0 | drill 0.813 pad 1.905: - 1.27,0
SMD0805 = smd 1.3 x 1.5: 1 -0.95,0; 2 0.95,0
SMA = smd 2.2 x 2.2: A 2,0; C -2,0
SOD80C = smd 1.4 x 1.8: A 1.7,0; C -1.7,0
SOD123 = smd 1.4 x 1.4: A 1.9,0; C -1.9,0
DIODE = drill 0.8 pad 2: 1 -5.064,0.004; 2 5.096,0.004
CHIPLED_0805 = smd 1.2 x 1.2: A 0,-1.05; C 0,1.05
TB-2P = drill 1 pad 2.8 square: 1 0.037,2.432; 2 -0.048,-2.533
CT6 = drill 0.813 octagon: A 2.515,0; E -2.515,0; S 0,-2.54
PUSH_BUTTON_4P = drill 1.016 long: 1 -3.251,2.261; 2 3.251,2.261; 3 -3.251,-2.261; 4 3.251,-2.261
TO220BV = drill 1.016 long: 1 -2.54,-2.54; 2 0,-2.54; 3 2.54,-2.54
SO08 = smd 0.66 x 2.032: 1 -1.905,-3.073; 2 -0.635,-3.073; 3 0.635,-3.073; 4 1.905,-3.073; 5 1.905,3.073; 6 0.635,3.073; 7 -0.635,3.073; 8 -1.905,3.073
SOT229P700X180-4N = smd 1.2 x 1.8: 1 -2.29,-3.472; 2 0,-3.472; 3 2.29,-3.472 | smd 3.4 x 1.8: 4 0,3.218
SO14 = smd 0.66 x 2.032: 1 -3.81,-3.073; 2 -2.54,-3.073; 3 -1.27,-3.073; 4 0,-3.073; 5 1.27,-3.073; 6 2.54,-3.073; 7 3.81,-3.073; 8 3.81,3.073; 9 2.54,3.073; 10 1.27,3.073; 11 0,3.073; 12 -1.27,3.073; 13 -2.54,3.073; 14 -3.81,3.073
SO16 = smd 0.66 x 2.032: 1 -4.445,-3.073; 2 -3.175,-3.073; 3 -1.905,-3.073; 4 -0.635,-3.073; 5 0.635,-3.073; 6 1.905,-3.073; 7 3.175,-3.073; 8 4.445,-3.073; 9 4.445,3.073; 10 3.175,3.073; 11 1.905,3.073; 12 0.635,3.073; 13 -0.635,3.073; 14 -1.905,3.073; 15 -3.175,3.073; 16 -4.445,3.073
22-23-2021 = drill 1 long: 1 -1.27,0; 2 1.27,0

### Placement (x,y rotation side)
C1  19.3,74.59 90 top
C2  11.9,74.57 90 top
C3  -63.5,111.76 0 top  (outside the outline)
C4  -68.58,111.76 0 top  (outside the outline)
C5  -73.66,111.76 0 top  (outside the outline)
C6  -78.74,111.76 0 top  (outside the outline)
C7  -83.82,111.76 0 top  (outside the outline)
C8  -88.9,111.76 0 top  (outside the outline)
C9  -93.98,111.76 0 top  (outside the outline)
C10  -24.13,106.68 0 top  (outside the outline)
C11  -53.34,111.76 0 top  (outside the outline)
C12  -30.48,106.68 0 top  (outside the outline)
C13  -36.83,106.68 0 top  (outside the outline)
C14  20.21,36.79 0 bottom
C15  20.14,27.94 180 bottom
C16  42.06,48.62 180 top
C17  63.59,36.55 0 top
C18  62.59,32.23 180 bottom
C19  41.89,32.36 180 bottom
C20  26.64,13.99 180 bottom
C21  41.91,14.03 0 bottom
C22  63.6,6.81 270 bottom
C23  63.57,6.81 270 top
C24  58.96,60.39 90 top
C25  37.59,60.24 90 top
C26  41.91,14.02 180 top
C27  26.61,14 180 top
C28  20.36,32.98 180 top
C29  20.19,36.74 0 top
C30  60.31,69.96 0 bottom
C31  46.36,69.98 0 bottom
C32  32.06,69.95 0 bottom
D1  10.2,66.04 270 top
D2  -44.45,45.72 0 top  (outside the outline)
D3  -54.61,45.72 0 top  (outside the outline)
D4  -64.77,45.72 0 top  (outside the outline)
D5  -74.93,45.72 0 top  (outside the outline)
D6  -85.09,45.72 0 top  (outside the outline)
D7  -95.25,45.72 0 top  (outside the outline)
D8  54.17,21.33 270 top
D9  52.22,21.34 270 top
D10  50.27,21.32 270 top
D11  51.28,21.3 270 bottom
D12  53.13,21.28 270 bottom
D13  52.17,30.24 90 bottom
D14  -78.74,52.07 0 top  (outside the outline)
D15  54.12,30.23 90 bottom
D16  50.27,30.25 90 bottom
D17  50.28,30.26 90 top
D18  54.13,30.28 90 top
D19  52.18,30.25 90 top
D20  -40.48,12.32 0 top  (outside the outline)
D21  -40.51,10.32 0 top  (outside the outline)
D22  -40.54,10.33 180 bottom  (outside the outline)
D23  -40.47,12.33 180 bottom  (outside the outline)
D24  -40.5,14.28 180 bottom  (outside the outline)
D25  -40.54,14.27 0 top  (outside the outline)
D26  -33.02,64.77 0 top  (outside the outline)
D27  -44.45,64.77 0 top  (outside the outline)
D28  -55.88,64.77 0 top  (outside the outline)
D29  -67.31,64.77 0 top  (outside the outline)
D30  -78.74,64.77 0 top  (outside the outline)
D31  -90.17,64.77 0 top  (outside the outline)
D32  -101.6,64.77 0 top  (outside the outline)
D33  -21.59,71.12 0 top  (outside the outline)
D34  -33.02,71.12 0 top  (outside the outline)
D35  -44.45,71.12 0 top  (outside the outline)
D36  -55.88,71.12 0 top  (outside the outline)
D37  -67.31,71.12 0 top  (outside the outline)
D38  -78.74,71.12 0 top  (outside the outline)
D39  -90.17,71.12 0 top  (outside the outline)
D40  -101.6,71.12 0 top  (outside the outline)
D41  -21.59,77.47 0 top  (outside the outline)
D42  -33.02,77.47 0 top  (outside the outline)
D43  -44.45,77.47 0 top  (outside the outline)
D44  -55.88,77.47 0 top  (outside the outline)
D45  -67.31,77.47 0 top  (outside the outline)
D46  -78.74,77.47 0 top  (outside the outline)
D47  -90.17,77.47 0 top  (outside the outline)
D48  -101.6,77.47 0 top  (outside the outline)
D53  -21.59,83.82 0 top  (outside the outline)
D54  -33.02,83.82 0 top  (outside the outline)
D55  -44.45,83.82 0 top  (outside the outline)
D56  -55.88,83.82 0 top  (outside the outline)
D58  -67.31,83.82 0 top  (outside the outline)
D59  -78.74,83.82 0 top  (outside the outline)
D60  -90.17,83.82 0 top  (outside the outline)
D63  90.7,49.17 180 top
D64  -101.6,83.82 0 top  (outside the outline)
D65  -21.59,90.17 0 top  (outside the outline)
D66  -33.02,90.17 0 top  (outside the outline)
D67  -44.45,90.17 0 top  (outside the outline)
D68  -55.88,90.17 0 top  (outside the outline)
D69  -67.31,90.17 0 top  (outside the outline)
D70  -78.74,90.17 0 top  (outside the outline)
D71  -90.17,90.17 0 top  (outside the outline)
D72  -101.6,90.17 0 top  (outside the outline)
D73  -21.59,96.52 0 top  (outside the outline)
LED1  84.99,6.36 270 top
LED2  77.14,11.46 270 top
LED3  77.14,18.56 270 top
LED4  84.99,23.61 270 top
LED5  92.84,18.56 270 top
LED6  92.74,11.41 270 top
P1  3.68,65.93 180 top
R1  -99.06,111.76 0 top  (outside the outline)
R2  -104.14,111.76 0 top  (outside the outline)
R3  -109.22,111.76 0 top  (outside the outline)
R4  -15.24,116.84 0 top  (outside the outline)
R5  -20.32,116.84 0 top  (outside the outline)
R6  -25.4,116.84 0 top  (outside the outline)
R7  -30.48,116.84 0 top  (outside the outline)
R8  85,15.05 0 top
R9  -35.56,116.84 0 top  (outside the outline)
R10  -43.18,106.68 0 top  (outside the outline)
R11  -58.42,111.76 0 top  (outside the outline)
R12  -49.53,106.68 0 top  (outside the outline)
R13  -55.88,106.68 0 top  (outside the outline)
R14  -62.23,106.68 0 top  (outside the outline)
R15  -68.58,106.68 0 top  (outside the outline)
R16  -74.93,106.68 0 top  (outside the outline)
R17  32.02,75.02 180 bottom
R18  46.27,75.07 180 bottom
R19  60.37,75.02 180 bottom
R20  -100.33,106.68 0 top  (outside the outline)
R21  -106.68,106.68 0 top  (outside the outline)
R22  -113.03,106.68 0 top  (outside the outline)
R23  -16.51,111.76 0 top  (outside the outline)
R24  -22.86,111.76 0 top  (outside the outline)
R25  -29.21,111.76 0 top  (outside the outline)
R26  -35.56,111.76 0 top  (outside the outline)
R27  -41.91,111.76 0 top  (outside the outline)
R29  -48.26,111.76 0 top  (outside the outline)
SW1  39.32,75.01 0 top
SW2  53.26,75.01 0 top
SW3  67.15,75.01 0 top
T1  90.95,45.59 0 top
U1  20.22,23.74 270 bottom
U2  14.65,66.07 90 bottom
U3  56.55,7.92 90 top
U4  56.5,7.91 270 bottom
U5  62.51,25.88 270 top
U6  62.54,25.86 270 bottom
U7  41.76,26.24 270 top
U8  52.32,60.49 180 top
U9  31.4,60.24 180 top
U10  20.2,42.76 90 top
U11  63.6,42.61 90 top
U12  42.05,42.54 270 top
U13  20.25,42.81 90 bottom
U14  41.89,7.78 270 bottom
U15  41.91,7.81 270 top
U16  41.84,26.24 270 bottom
U17  26.7,7.57 270 bottom
U18  26.7,7.6 270 top
U19  20.25,26.32 270 top
X1  90.92,55.65 180 top

### Tracks (layer width: path | path; a pad name or v marks a point on that pad's centre or on a via)
25  (2 unrouted)
50  (2 unrouted)
75  (2 unrouted)
100  (1 unrouted)
A  (2 unrouted)
A-C  (2 unrouted)
A_  (8 unrouted)
ANALOG  (10 unrouted)
B  (2 unrouted)
B-C  (1 unrouted)
B_  (8 unrouted)
C  (2 unrouted)
C-C  (1 unrouted)
C_  (8 unrouted)
CLOCK  (2 unrouted)
D  (2 unrouted)
D-C  (2 unrouted)
D_  (8 unrouted)
E  (2 unrouted)
E-C  (2 unrouted)
E_  (8 unrouted)
ENABLE_CLOCK  (4 unrouted)
F  (2 unrouted)
F-C  (2 unrouted)
F_  (8 unrouted)
G-C  (2 unrouted)
GND  (74 unrouted)
N$1  (1 unrouted)
N$2  (2 unrouted)
N$3  (2 unrouted)
N$4  (2 unrouted)
N$5  (2 unrouted)
N$6  (2 unrouted)
N$7  (2 unrouted)
N$8  (2 unrouted)
N$9  (2 unrouted)
N$10  (2 unrouted)
N$11  (2 unrouted)
N$12  (3 unrouted)
N$13  (2 unrouted)
N$14  (2 unrouted)
N$15  (1 unrouted)
N$16  (3 unrouted)
N$17  (3 unrouted)
N$18  (2 unrouted)
N$19  (3 unrouted)
N$20  (1 unrouted)
N$21  (3 unrouted)
N$22  (6 unrouted)
N$23  (3 unrouted)
N$24  (6 unrouted)
N$25  (3 unrouted)
N$26  (6 unrouted)
N$27  (1 unrouted)
N$28  (6 unrouted)
N$29  (6 unrouted)
N$30  (1 unrouted)
N$31  (1 unrouted)
N$32  (1 unrouted)
N$33  (1 unrouted)
N$34  (1 unrouted)
N$35  (1 unrouted)
N$36  (1 unrouted)
N$37  (1 unrouted)
N$38  (1 unrouted)
N$39  (1 unrouted)
N$40  (1 unrouted)
N$41  (6 unrouted)
N$42  (1 unrouted)
N$43  (1 unrouted)
N$44  (1 unrouted)
N$45  (1 unrouted)
N$46  (1 unrouted)
N$47  (2 unrouted)
N$48  (1 unrouted)
N$49  (1 unrouted)
N$50  (1 unrouted)
N$51  (1 unrouted)
N$52  (via drill 3 pad 5)
  other vias: 95,5
N$53  (1 unrouted)
N$54  (1 unrouted)
N$55  (1 unrouted)
N$56  (1 unrouted)
N$57  (1 unrouted)
N$59  (via drill 3 pad 5)
  other vias: 5,5
N$60  (via drill 3 pad 5)
  other vias: 5,75
N$61  (via drill 3 pad 5)
  other vias: 95,75
N$63  (1 unrouted)
OFF_SR  (1 unrouted)
ON_SR_LATCH  (2 unrouted)
Q1  (2 unrouted)
Q2  (3 unrouted)
Q3  (3 unrouted)
Q4  (3 unrouted)
Q5  (3 unrouted)
RESET_SW_SR  (13 unrouted)
SR_25  (1 unrouted)
SR_50  (1 unrouted)
SR_75  (1 unrouted)
SR_DRIVER_1  (1 unrouted)
SR_DRIVER_2  (1 unrouted)
SR_DRIVER_3  (1 unrouted)
SR_SW1  (2 unrouted)
SR_SW2  (2 unrouted)
SR_SW3  (2 unrouted)
SW1  (4 unrouted)
SW2  (4 unrouted)
SW3  (5 unrouted)
VCC  (54 unrouted)
~OFF_SR  (3 unrouted)

### Text on the board
tPlace: Motor